# EAGLE schematic XMICRO-VDP V1.1 (EAGLE 6.3)

## Sheet 1 of 5: Bus Connections/Buffers
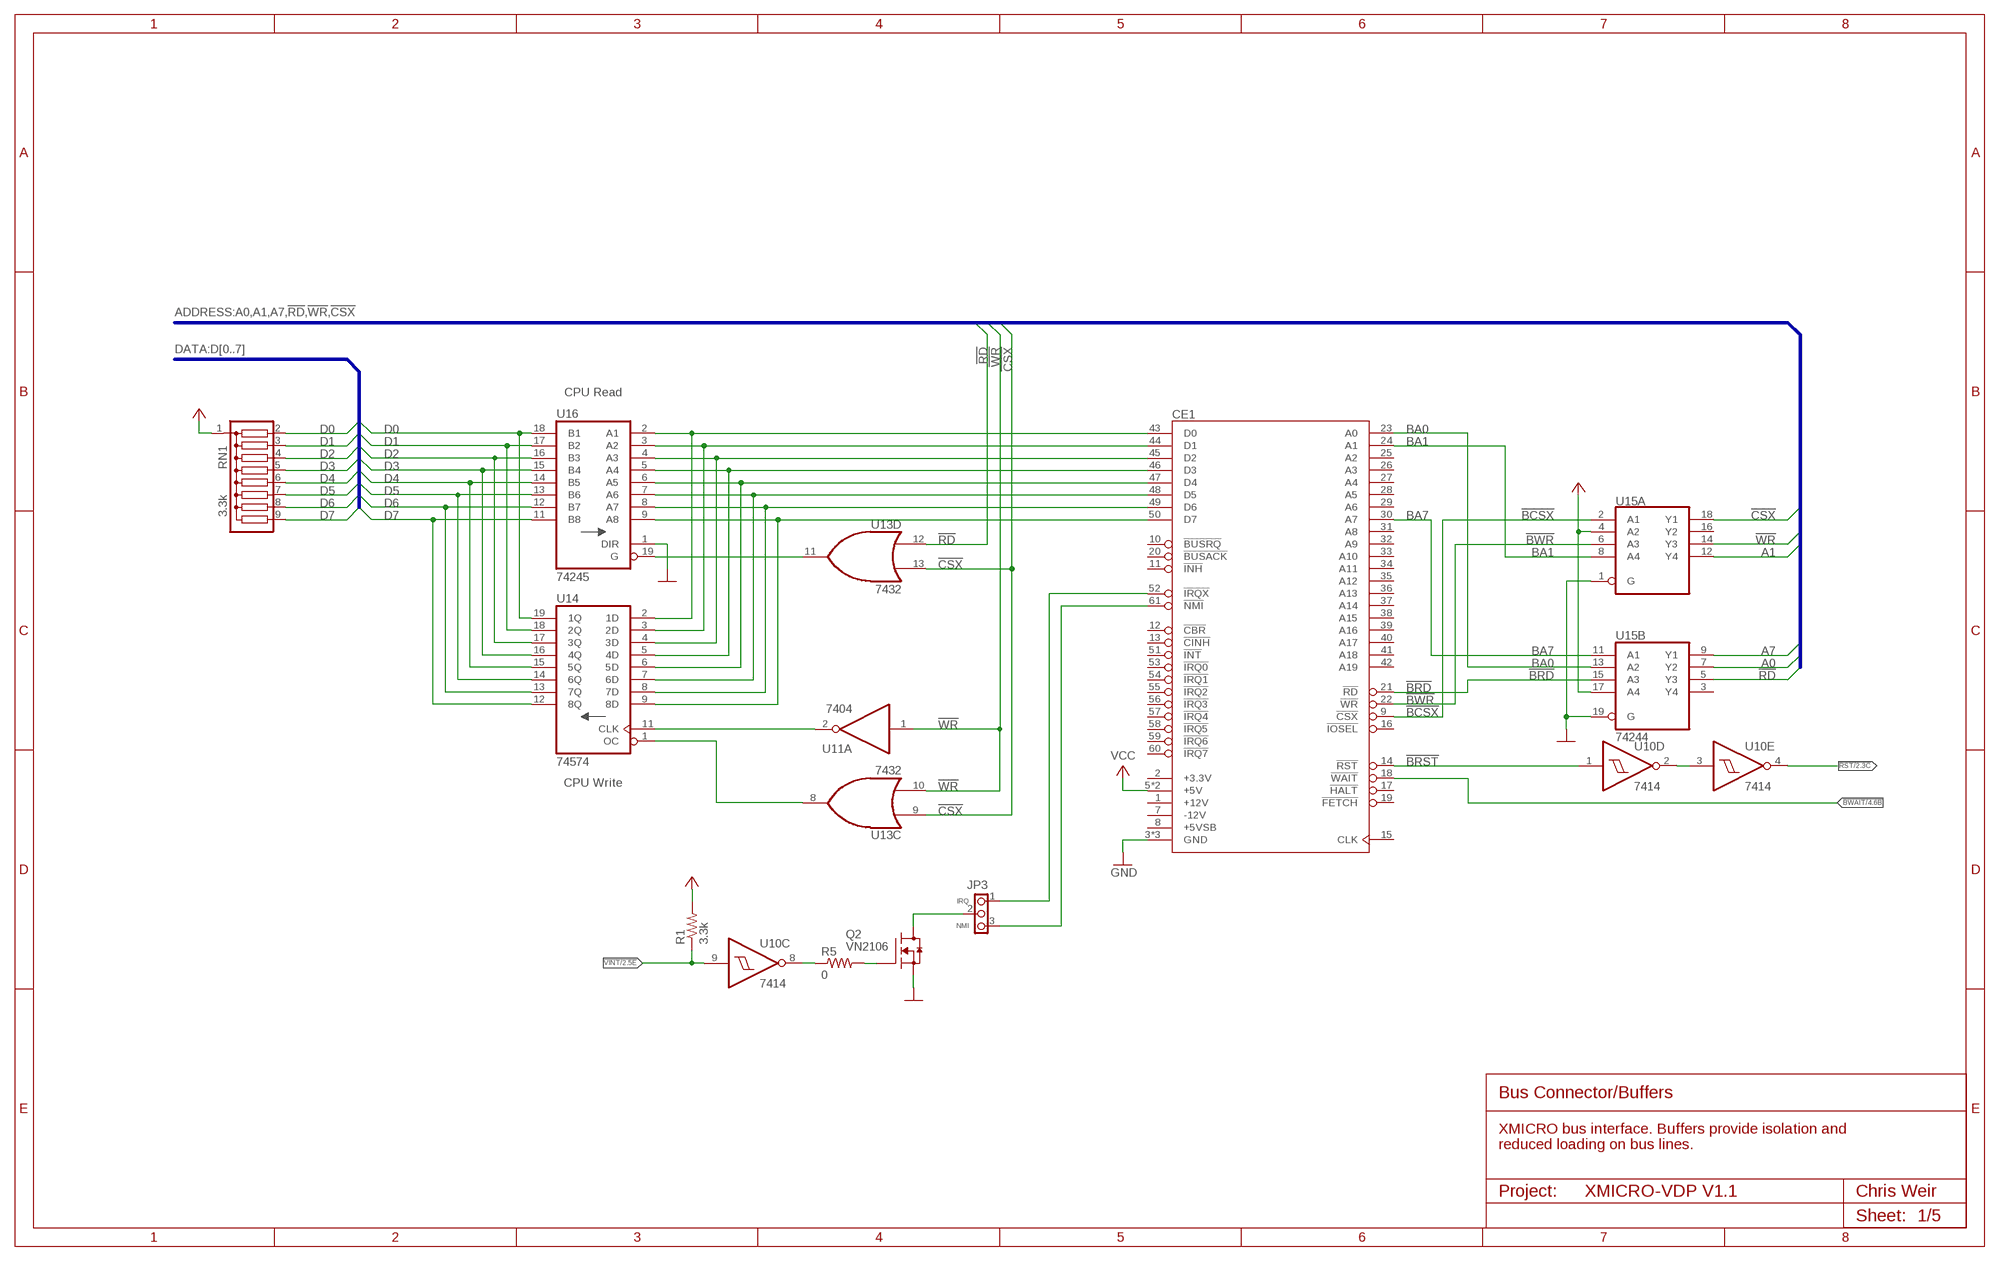
[diagram p0: schematic, sheet 1]

### Parts
CE1  XMICRO-BUS-EDGE62M  [EDGE62M]
JP3  PINHD1X3THRU  [1X03]
Q2  VN2106  [TO92]
R1  3.3k  R-US_0207/10  [0207/10]
R5  0  R-US_0207/10  [0207/10]
RN1  3.3k  RN8  [SIL9]
U10  7414  74LS14N  [DIL14]
U11  7404  74LS04N  [DIL14]
U13  7432  74LS32N  [DIL14]
U14  74574  74HC574N  [DIL20]
U15  74244  74LS244N  [DIL20]
U16  74245  74LS245N  [DIL20]

### Nets
!BCSX: CE1.9(!CSX) U15.2(A:A1)
!BRD: CE1.21(!RD) U15.15(B:A3)
!BRST: CE1.14(!RST) U10.1(D:I)
!BWAIT: CE1.18(!WAIT) ; also sheet 4
!BWR: CE1.22(!WR) U15.6(A:A3)
!CSX: U13.9(C:I0) U13.13(D:I1) U15.18(A:Y1) ; also sheet 2,4
!RD: U13.12(D:I0) U15.5(B:Y3) ; also sheet 2
!RST: U10.4(E:O) ; also sheet 2,4
!VINT: R1.1 U10.9(C:I) ; also sheet 2
!WR: U11.1(A:I) U13.10(C:I1) U15.14(A:Y3) ; also sheet 2
A0: U15.7(B:Y2) ; also sheet 2
A1: U15.12(A:Y4) ; also sheet 2
A7: U15.9(B:Y1) ; also sheet 2
BA0: CE1.23(A0) U15.13(B:A2)
BA1: CE1.24(A1) U15.8(A:A4)
BA7: CE1.30(A7) U15.11(B:A1)
D0: RN1.2 U14.19(1Q) U16.18(B1) ; also sheet 2,5
D1: RN1.3 U14.18(2Q) U16.17(B2) ; also sheet 2,5
D2: RN1.4 U14.17(3Q) U16.16(B3) ; also sheet 2,5
D3: RN1.5 U14.16(4Q) U16.15(B4) ; also sheet 2,5
D4: RN1.6 U14.15(5Q) U16.14(B5) ; also sheet 2,5
D5: RN1.7 U14.14(6Q) U16.13(B6) ; also sheet 2,5
D6: RN1.8 U14.13(7Q) U16.12(B7) ; also sheet 2,5
D7: RN1.9 U14.12(8Q) U16.11(B8) ; also sheet 2,5
GND [GND]: CE1.3(GND) CE1.4(GND) CE1.62(GND) Q2.1(S) U15.1(A:G) U15.19(B:G) U16.1(DIR) ; also sheet 2,3,4,5
N$9: Q2.2(G) R5.2
N$10: JP3.2 Q2.3(D)
N$11: R5.1 U10.8(C:O)
N$27: U10.2(D:O) U10.3(E:I)
N$33: CE1.50(D7) U14.9(8D) U16.9(A8)
N$34: CE1.49(D6) U14.8(7D) U16.8(A7)
N$35: CE1.48(D5) U14.7(6D) U16.7(A6)
N$36: CE1.47(D4) U14.6(5D) U16.6(A5)
N$37: CE1.46(D3) U14.5(4D) U16.5(A4)
N$38: CE1.45(D2) U14.4(3D) U16.4(A3)
N$39: CE1.44(D1) U14.3(2D) U16.3(A2)
N$40: CE1.43(D0) U14.2(1D) U16.2(A1)
N$54: U13.11(D:O) U16.19(G)
N$55: U11.2(A:O) U14.11(CLK)
N$56: U13.8(C:O) U14.1(OC)
N$72: CE1.61(!NMI) JP3.3
N$74: CE1.52(!IRQX) JP3.1
VCC [SUPPLY]: CE1.5(+5V) CE1.6(+5V) R1.2 RN1.1 U15.4(A:A2) U15.17(B:A4) ; also sheet 2,3,4,5
Unconnected: CE1.1(+12V) CE1.2(+3.3V) CE1.7(-12V) CE1.8(+5VSB) CE1.10(!BUSRQ) CE1.11(!INH) CE1.12(!CBR) CE1.13(!CINH) CE1.15(CLK) CE1.16(!IOSEL) CE1.17(!HALT) CE1.19(!FETCH) CE1.20(!BUSACK) CE1.25(A2) CE1.26(A3) CE1.27(A4) CE1.28(A5) CE1.29(A6) CE1.31(A8) CE1.32(A9) CE1.33(A10) CE1.34(A11) CE1.35(A12) CE1.36(A13) CE1.37(A14) CE1.38(A15) CE1.39(A16) CE1.40(A17) CE1.41(A18) CE1.42(A19) CE1.51(!INT) CE1.53(!IRQ0) CE1.54(!IRQ1) CE1.55(!IRQ2) CE1.56(!IRQ3) CE1.57(!IRQ4) CE1.58(!IRQ5) CE1.59(!IRQ6) CE1.60(!IRQ7) U15.3(B:Y4) U15.16(A:Y2)

### Buses
DATA:D[0..7]
ADDRESS:A0,A1,A7,!RD,!WR,!CSX

### Notes on the sheet
- CPU Read
- CPU Write
- IRQ
- NMI
- Bus Connector/Buffers
- XMICRO bus interface. Buffers provide isolation and 
  reduced loading on bus lines.
- Project: | Chris Weir
- Sheet:

## Sheet 2 of 5: VDP - Digital
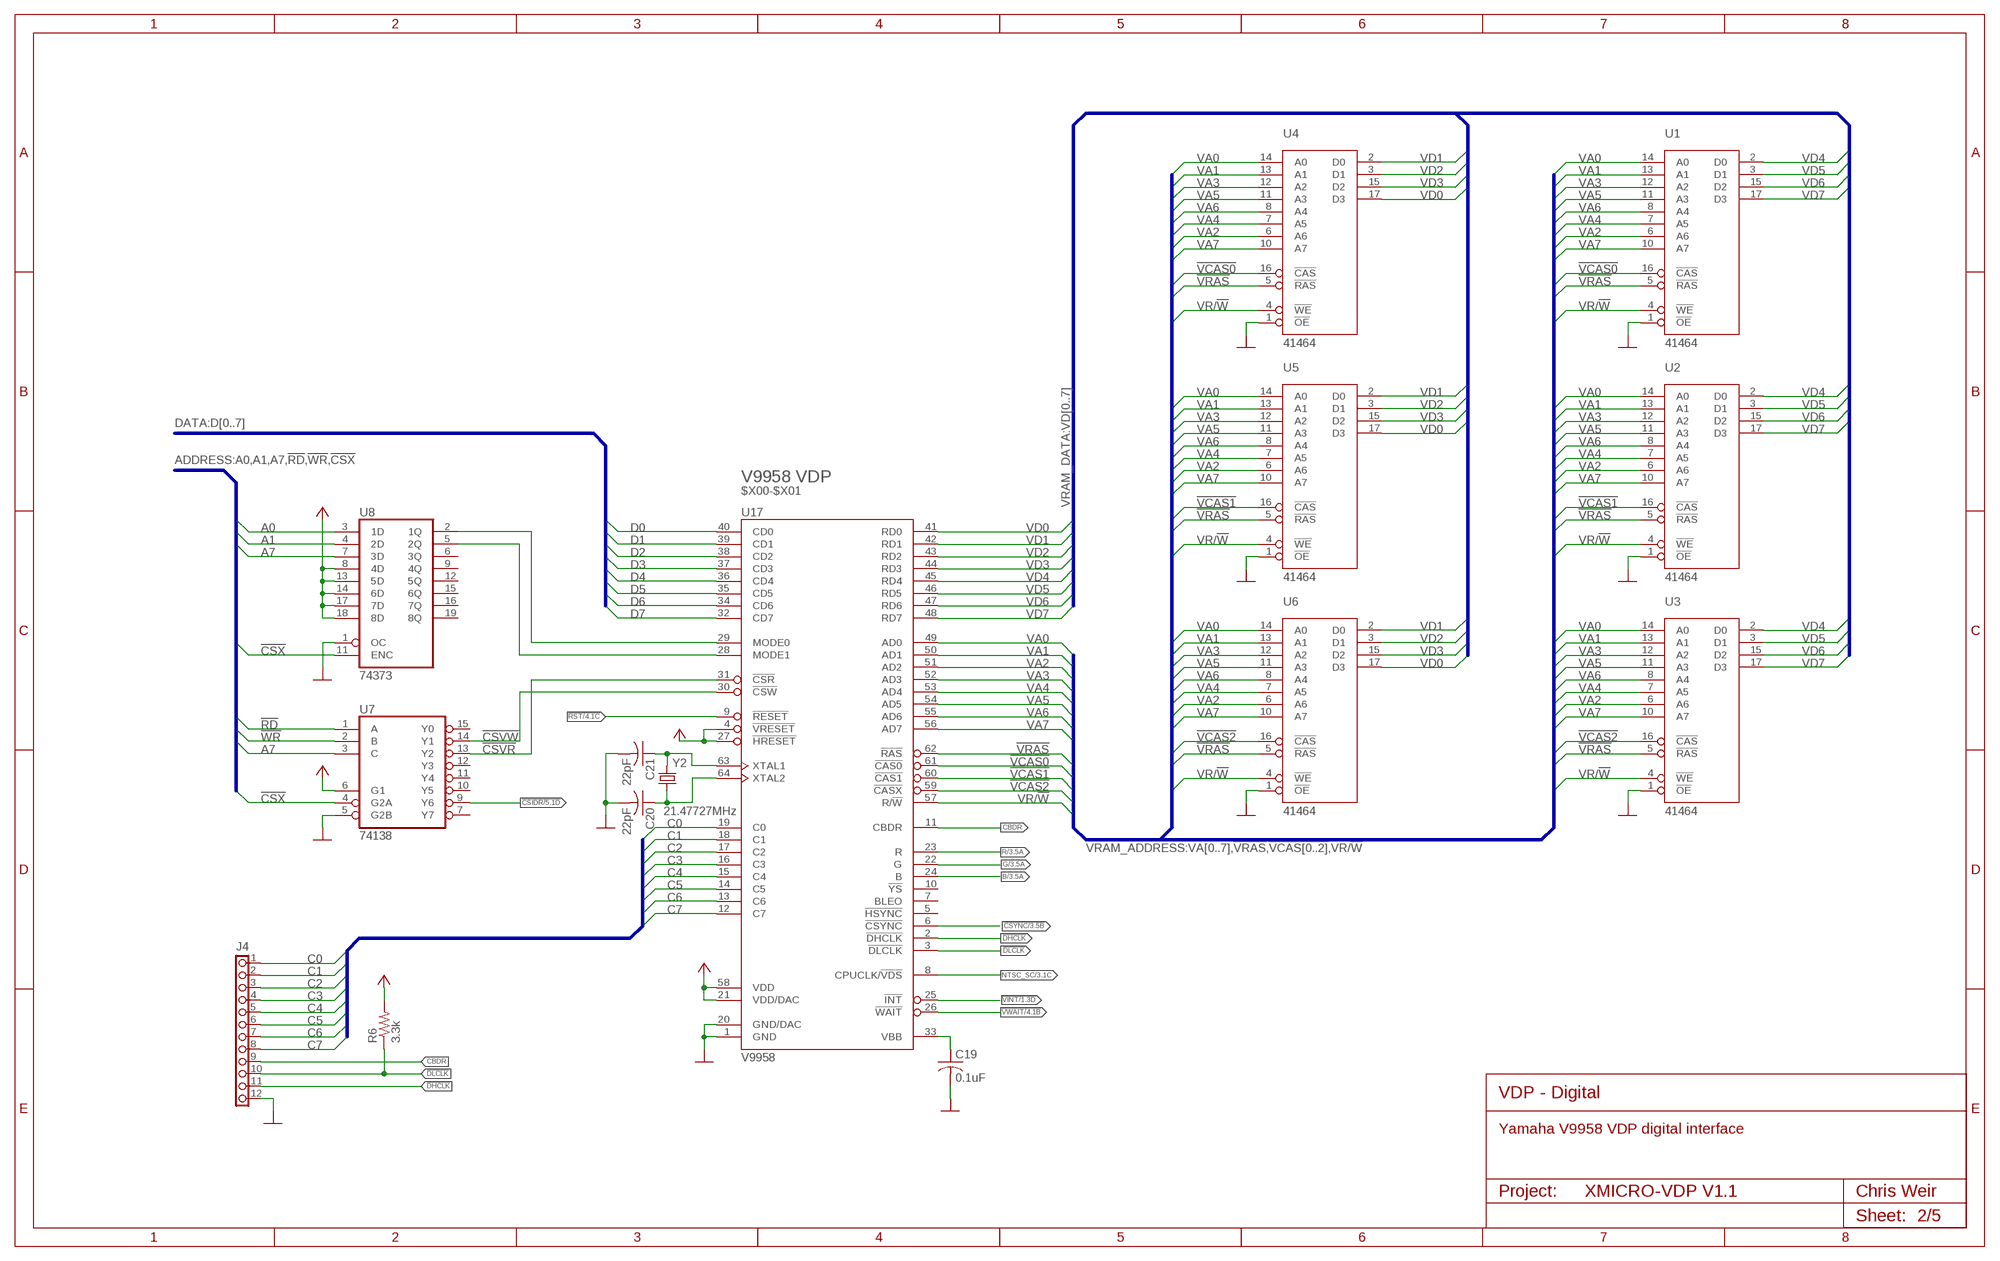
[diagram p1: schematic, sheet 2]

### Parts
C19  0.1uF  C-US100  [C100]
C20  22pF  C-US100  [C100]
C21  22pF  C-US100  [C100]
J4  PINHD-2X6  [2X06]
R6  3.3k  R-US_0207/10  [0207/10]
U1  41464  [DIL18]
U2  41464  [DIL18]
U3  41464  [DIL18]
U4  41464  [DIL18]
U5  41464  [DIL18]
U6  41464  [DIL18]
U7  74138  74S138N  [DIL16]
U8  74373  74LS373N  [DIL20]
U17  V9958  [SDIP64]
Y2  21.47727MHz  CRYSTAL  [HC-49US]

### Nets
!CSIDR: U7.9(Y6) ; also sheet 5
!CSVR: U7.13(Y2) U17.31(!CSR)
!CSVW: U7.14(Y1) U17.30(!CSW)
!CSX: U7.4(G2A) U8.11(ENC) ; also sheet 1,4
!CSYNC: U17.6(!CSYNC) ; also sheet 3
!DHCLK: J4.11 U17.2(!DHCLK)
!DLCLK: J4.10 R6.1 U17.3(!DLCLK)
!RD: U7.1(A) ; also sheet 1
!RST: U17.9(!RESET) ; also sheet 1,4
!VCAS0: U1.16(!CAS) U4.16(!CAS) U17.61(!CAS0)
!VCAS1: U2.16(!CAS) U5.16(!CAS) U17.60(!CAS1)
!VCAS2: U3.16(!CAS) U6.16(!CAS) U17.59(!CASX)
!VINT: U17.25(!INT) ; also sheet 1
!VRAS: U1.5(!RAS) U2.5(!RAS) U3.5(!RAS) U4.5(!RAS) U5.5(!RAS) U6.5(!RAS) U17.62(!RAS)
!VWAIT: U17.26(!WAIT) ; also sheet 4
!WR: U7.2(B) ; also sheet 1
A0: U8.3(1D) ; also sheet 1
A1: U8.4(2D) ; also sheet 1
A7: U7.3(C) U8.7(3D) ; also sheet 1
B: U17.24(B) ; also sheet 3
C0: J4.1 U17.19(C0)
C1: J4.2 U17.18(C1)
C2: J4.3 U17.17(C2)
C3: J4.4 U17.16(C3)
C4: J4.5 U17.15(C4)
C5: J4.6 U17.14(C5)
C6: J4.7 U17.13(C6)
C7: J4.8 U17.12(C7)
CBDR: J4.9 U17.11(CBDR)
D0: U17.40(CD0) ; also sheet 1,5
D1: U17.39(CD1) ; also sheet 1,5
D2: U17.38(CD2) ; also sheet 1,5
D3: U17.37(CD3) ; also sheet 1,5
D4: U17.36(CD4) ; also sheet 1,5
D5: U17.35(CD5) ; also sheet 1,5
D6: U17.34(CD6) ; also sheet 1,5
D7: U17.32(CD7) ; also sheet 1,5
G: U17.22(G) ; also sheet 3
GND [GND]: C19.P$2 C20.P$2 C21.P$2 J4.12 U1.1(!OE) U2.1(!OE) U3.1(!OE) U4.1(!OE) U5.1(!OE) U6.1(!OE) U7.5(G2B) U8.1(OC) U17.1(GND) U17.20(GND/DAC) ; also sheet 1,3,4,5
N$28: C21.P$1 U17.63(XTAL1) Y2.2
N$30: C20.P$1 U17.64(XTAL2) Y2.1
N$69: U8.2(1Q) U17.29(MODE0)
N$70: C19.P$1 U17.33(VBB)
N$75: U8.5(2Q) U17.28(MODE1)
NTSC_SC: U17.8(CPUCLK/!VDS) ; also sheet 3
R: U17.23(R) ; also sheet 3
VA0: U1.14(A0) U2.14(A0) U3.14(A0) U4.14(A0) U5.14(A0) U6.14(A0) U17.49(AD0)
VA1: U1.13(A1) U2.13(A1) U3.13(A1) U4.13(A1) U5.13(A1) U6.13(A1) U17.50(AD1)
VA2: U1.6(A6) U2.6(A6) U3.6(A6) U4.6(A6) U5.6(A6) U6.6(A6) U17.51(AD2)
VA3: U1.12(A2) U2.12(A2) U3.12(A2) U4.12(A2) U5.12(A2) U6.12(A2) U17.52(AD3)
VA4: U1.7(A5) U2.7(A5) U3.7(A5) U4.7(A5) U5.7(A5) U6.7(A5) U17.53(AD4)
VA5: U1.11(A3) U2.11(A3) U3.11(A3) U4.11(A3) U5.11(A3) U6.11(A3) U17.54(AD5)
VA6: U1.8(A4) U2.8(A4) U3.8(A4) U4.8(A4) U5.8(A4) U6.8(A4) U17.55(AD6)
VA7: U1.10(A7) U2.10(A7) U3.10(A7) U4.10(A7) U5.10(A7) U6.10(A7) U17.56(AD7)
VCC [SUPPLY]: R6.2 U7.6(G1) U8.8(4D) U8.13(5D) U8.14(6D) U8.17(7D) U8.18(8D) U17.4(!VRESET) U17.21(VDD/DAC) U17.27(!HRESET) U17.58(VDD) ; also sheet 1,3,4,5
VD0: U4.17(D3) U5.17(D3) U6.17(D3) U17.41(RD0)
VD1: U4.2(D0) U5.2(D0) U6.2(D0) U17.42(RD1)
VD2: U4.3(D1) U5.3(D1) U6.3(D1) U17.43(RD2)
VD3: U4.15(D2) U5.15(D2) U6.15(D2) U17.44(RD3)
VD4: U1.2(D0) U2.2(D0) U3.2(D0) U17.45(RD4)
VD5: U1.3(D1) U2.3(D1) U3.3(D1) U17.46(RD5)
VD6: U1.15(D2) U2.15(D2) U3.15(D2) U17.47(RD6)
VD7: U1.17(D3) U2.17(D3) U3.17(D3) U17.48(RD7)
VR/!W: U1.4(!WE) U2.4(!WE) U3.4(!WE) U4.4(!WE) U5.4(!WE) U6.4(!WE) U17.57(R/!W)
Unconnected: U7.7(Y7) U7.10(Y5) U7.11(Y4) U7.12(Y3) U7.15(Y0) U8.6(3Q) U8.9(4Q) U8.12(5Q) U8.15(6Q) U8.16(7Q) U8.19(8Q) U17.5(!HSYNC) U17.7(BLEO) U17.10(!YS)

### Buses
DATA:D[0..7]
ADDRESS:A0,A1,A7,!RD,!WR,!CSX
VRAM_DATA:VD[0..7]
VRAM_ADDRESS:VA[0..7],!VRAS,!VCAS[0..2],VR/!W
COLOR:C[0..7],CBDIR

### Notes on the sheet
- V9958 VDP
- $X00-$X01
- VDP - Digital
- Yamaha V9958 VDP digital interface
- Project: | Chris Weir
- Sheet:

## Sheet 3 of 5: Analog Video
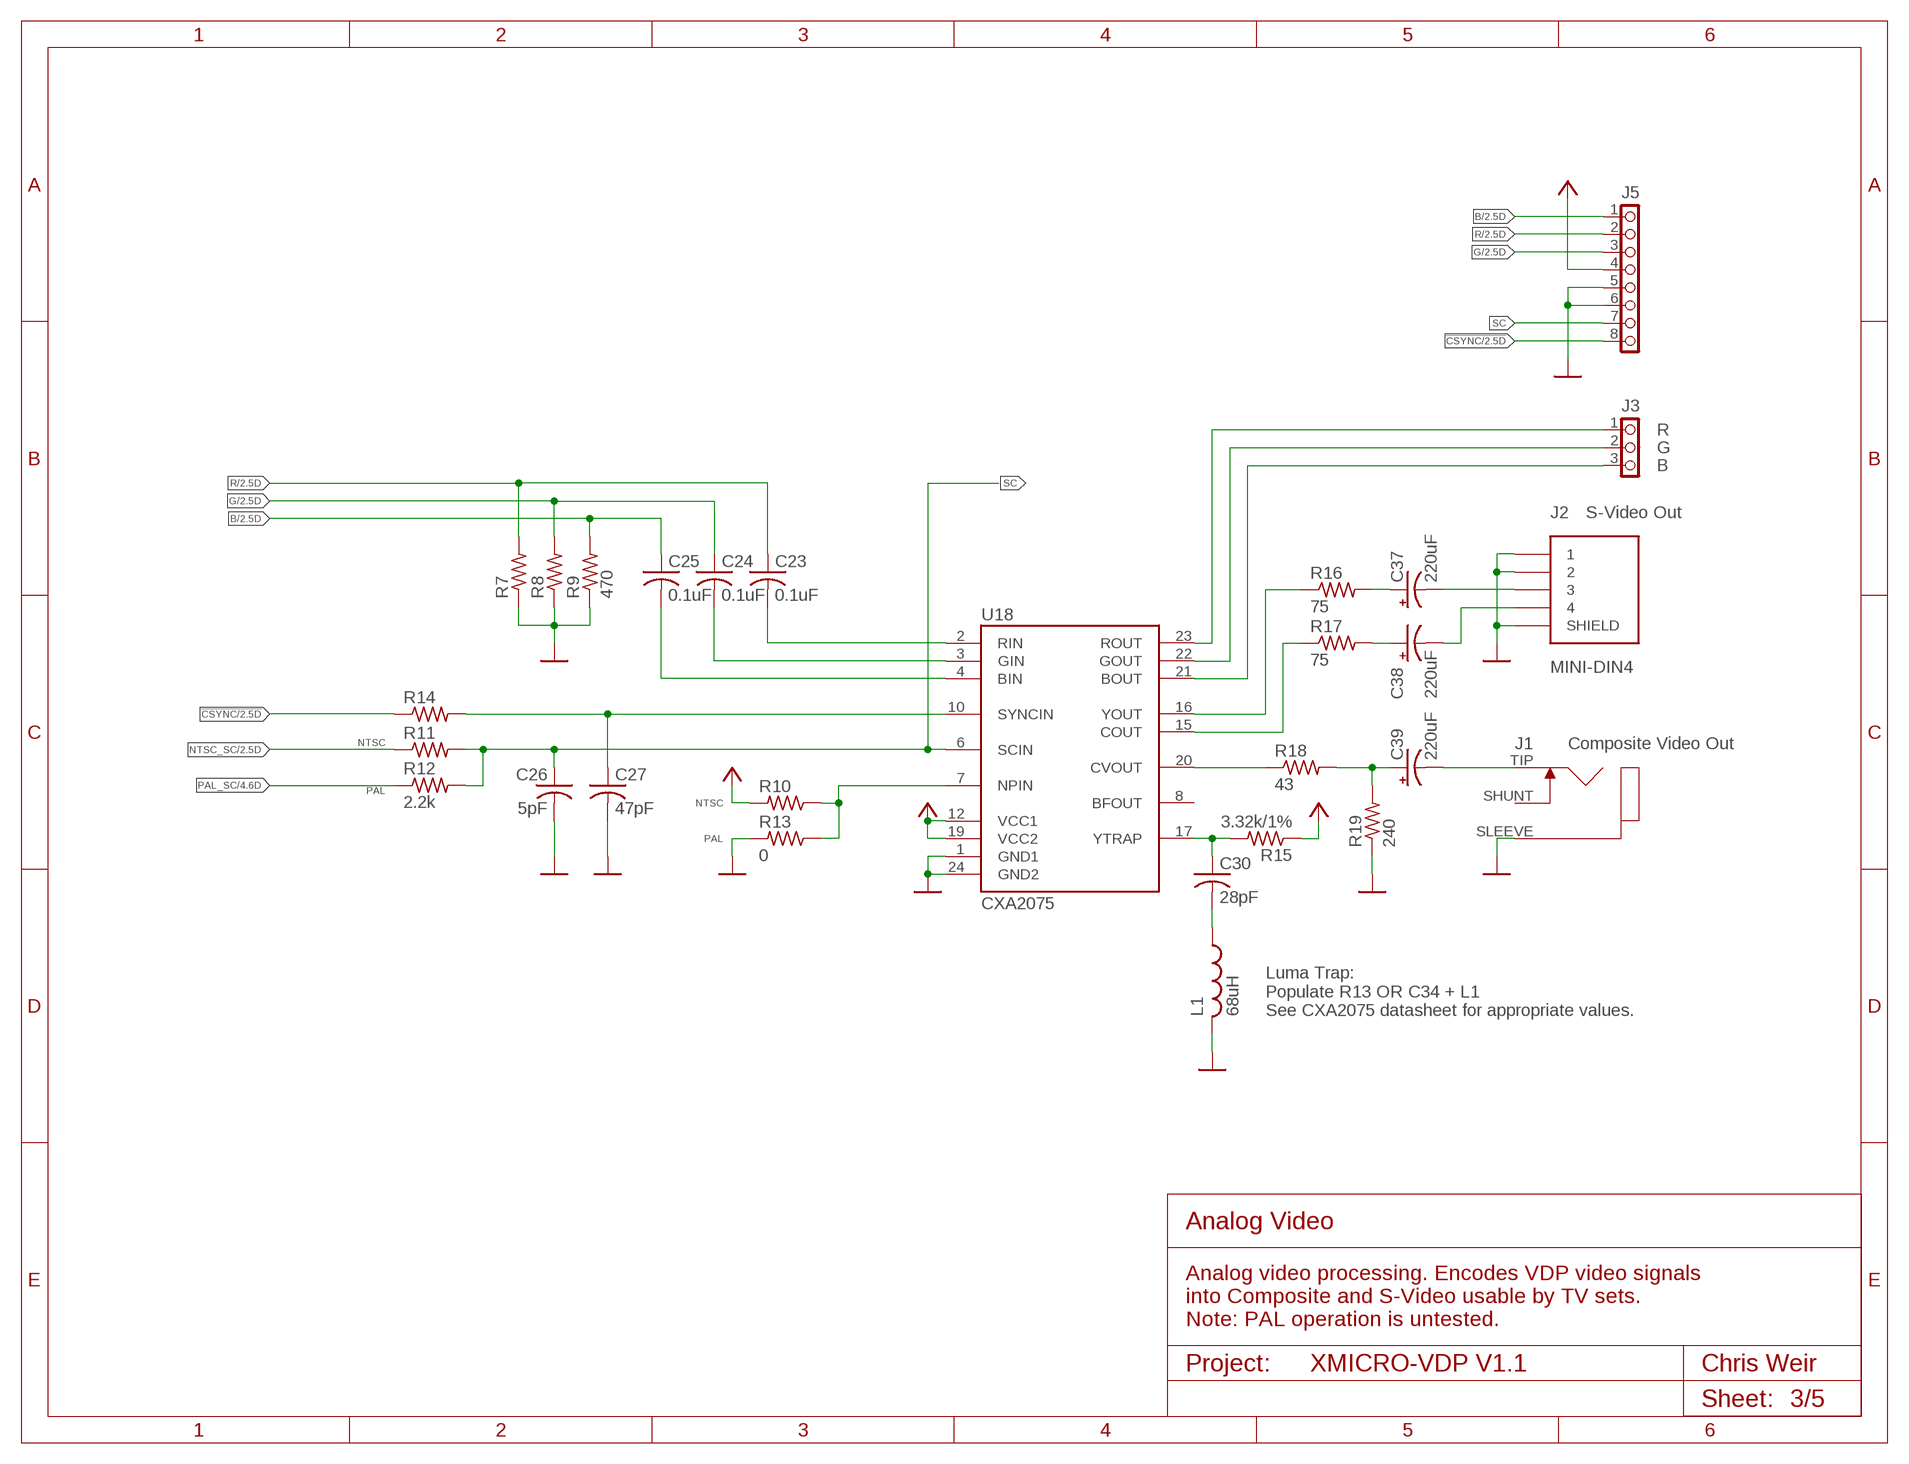
[diagram p2: schematic, sheet 3]

### Parts
C23  0.1uF  C-US100  [C100]
C24  0.1uF  C-US100  [C100]
C25  0.1uF  C-US100  [C100]
C26  5pF  C-US100  [C100]
C27  47pF  C-US100  [C100]
C30  28pF  C-US100  [C100]
C37  220uF  CPOL-USE2.5-7  [E2,5-7]
C38  220uF  CPOL-USE2.5-7  [E2,5-7]
C39  220uF  CPOL-USE2.5-7  [E2,5-7]
J1  PJRAN1XU04AUX  PJRAN1  [PJRAN1]
J2  MINI-DIN4  [MINI-DIN4]
J3  PINHD1X3  [1X03]
J5  PINHD-1X8  [1X08]
L1  68uH  L-US0207/10  [0207/10]
R7  470  R-US_0207/10  [0207/10]
R8  470  R-US_0207/10  [0207/10]
R9  470  R-US_0207/10  [0207/10]
R10  0  R-US_0207/10  [0207/10]
R11  2.2k  R-US_0207/10  [0207/10]
R12  2.2k  R-US_0207/10  [0207/10]
R13  0  R-US_0207/10  [0207/10]
R14  2.2k  R-US_0207/10  [0207/10]
R15  3.32k/1%  R-US_0207/10  [0207/10]
R16  75  R-US_0207/10  [0207/10]
R17  75  R-US_0207/10  [0207/10]
R18  43  R-US_0207/10  [0207/10]
R19  240  R-US_0207/10  [0207/10]
U18  CXA2075  [SOP-24]

### Nets
!CSYNC: J5.8 R14.1 ; also sheet 2
B: C25.P$1 J5.1 R9.2 ; also sheet 2
G: C24.P$1 J5.3 R8.2 ; also sheet 2
GND [GND]: C26.P$2 C27.P$2 J1.SLEEVE J2.1 J2.2 J2.G$1(SHIELD) J2.G$2(SHIELD) J2.G$3(SHIELD) J5.5 J5.6 L1.2 R7.1 R8.1 R9.1 R13.2 R19.1 U18.1(GND1) U18.24(GND2) ; also sheet 1,2,4,5
N$2: J3.3 U18.21(BOUT)
N$3: C23.P$2 U18.2(RIN)
N$4: C24.P$2 U18.3(GIN)
N$5: C25.P$2 U18.4(BIN)
N$6: J3.2 U18.22(GOUT)
N$7: J3.1 U18.23(ROUT)
N$12: R17.1 U18.15(COUT)
N$13: R16.1 U18.16(YOUT)
N$14: R18.1 U18.20(CVOUT)
N$15: C39.+ R18.2 R19.2
N$16: C37.+ R16.2
N$17: C38.+ R17.2
N$21: C30.P$2 L1.1
N$22: C27.P$1 R14.2 U18.10(SYNCIN)
N$26: R10.1 R13.1 U18.7(NPIN)
N$29: C38.- J2.4
N$53: C39.- J1.TIP
N$71: C30.P$1 R15.2 U18.17(YTRAP)
N$81: C37.- J2.3
NTSC_SC: R11.1 ; also sheet 2
PAL_SC: R12.1 ; also sheet 4
R: C23.P$1 J5.2 R7.2 ; also sheet 2
SC: C26.P$1 J5.7 R11.2 R12.2 U18.6(SCIN)
VCC [SUPPLY]: J5.4 R10.2 R15.1 U18.12(VCC1) U18.19(VCC2) ; also sheet 1,2,4,5
Unconnected: J1.SHUNT U18.8(BFOUT)

### Notes on the sheet
- R
- G
- B
- S-Video Out
- NTSC
- Composite Video Out
- PAL
- NTSC
- PAL
- Luma Trap:
  Populate R13 OR C34 + L1
  See CXA2075 datasheet for appropriate values.
- Analog Video
- Analog video processing. Encodes VDP video signals
  into Composite and S-Video usable by TV sets.
  Note: PAL operation is untested.
- Project: | Chris Weir
- Sheet:

## Sheet 4 of 5: Wait-State Generator
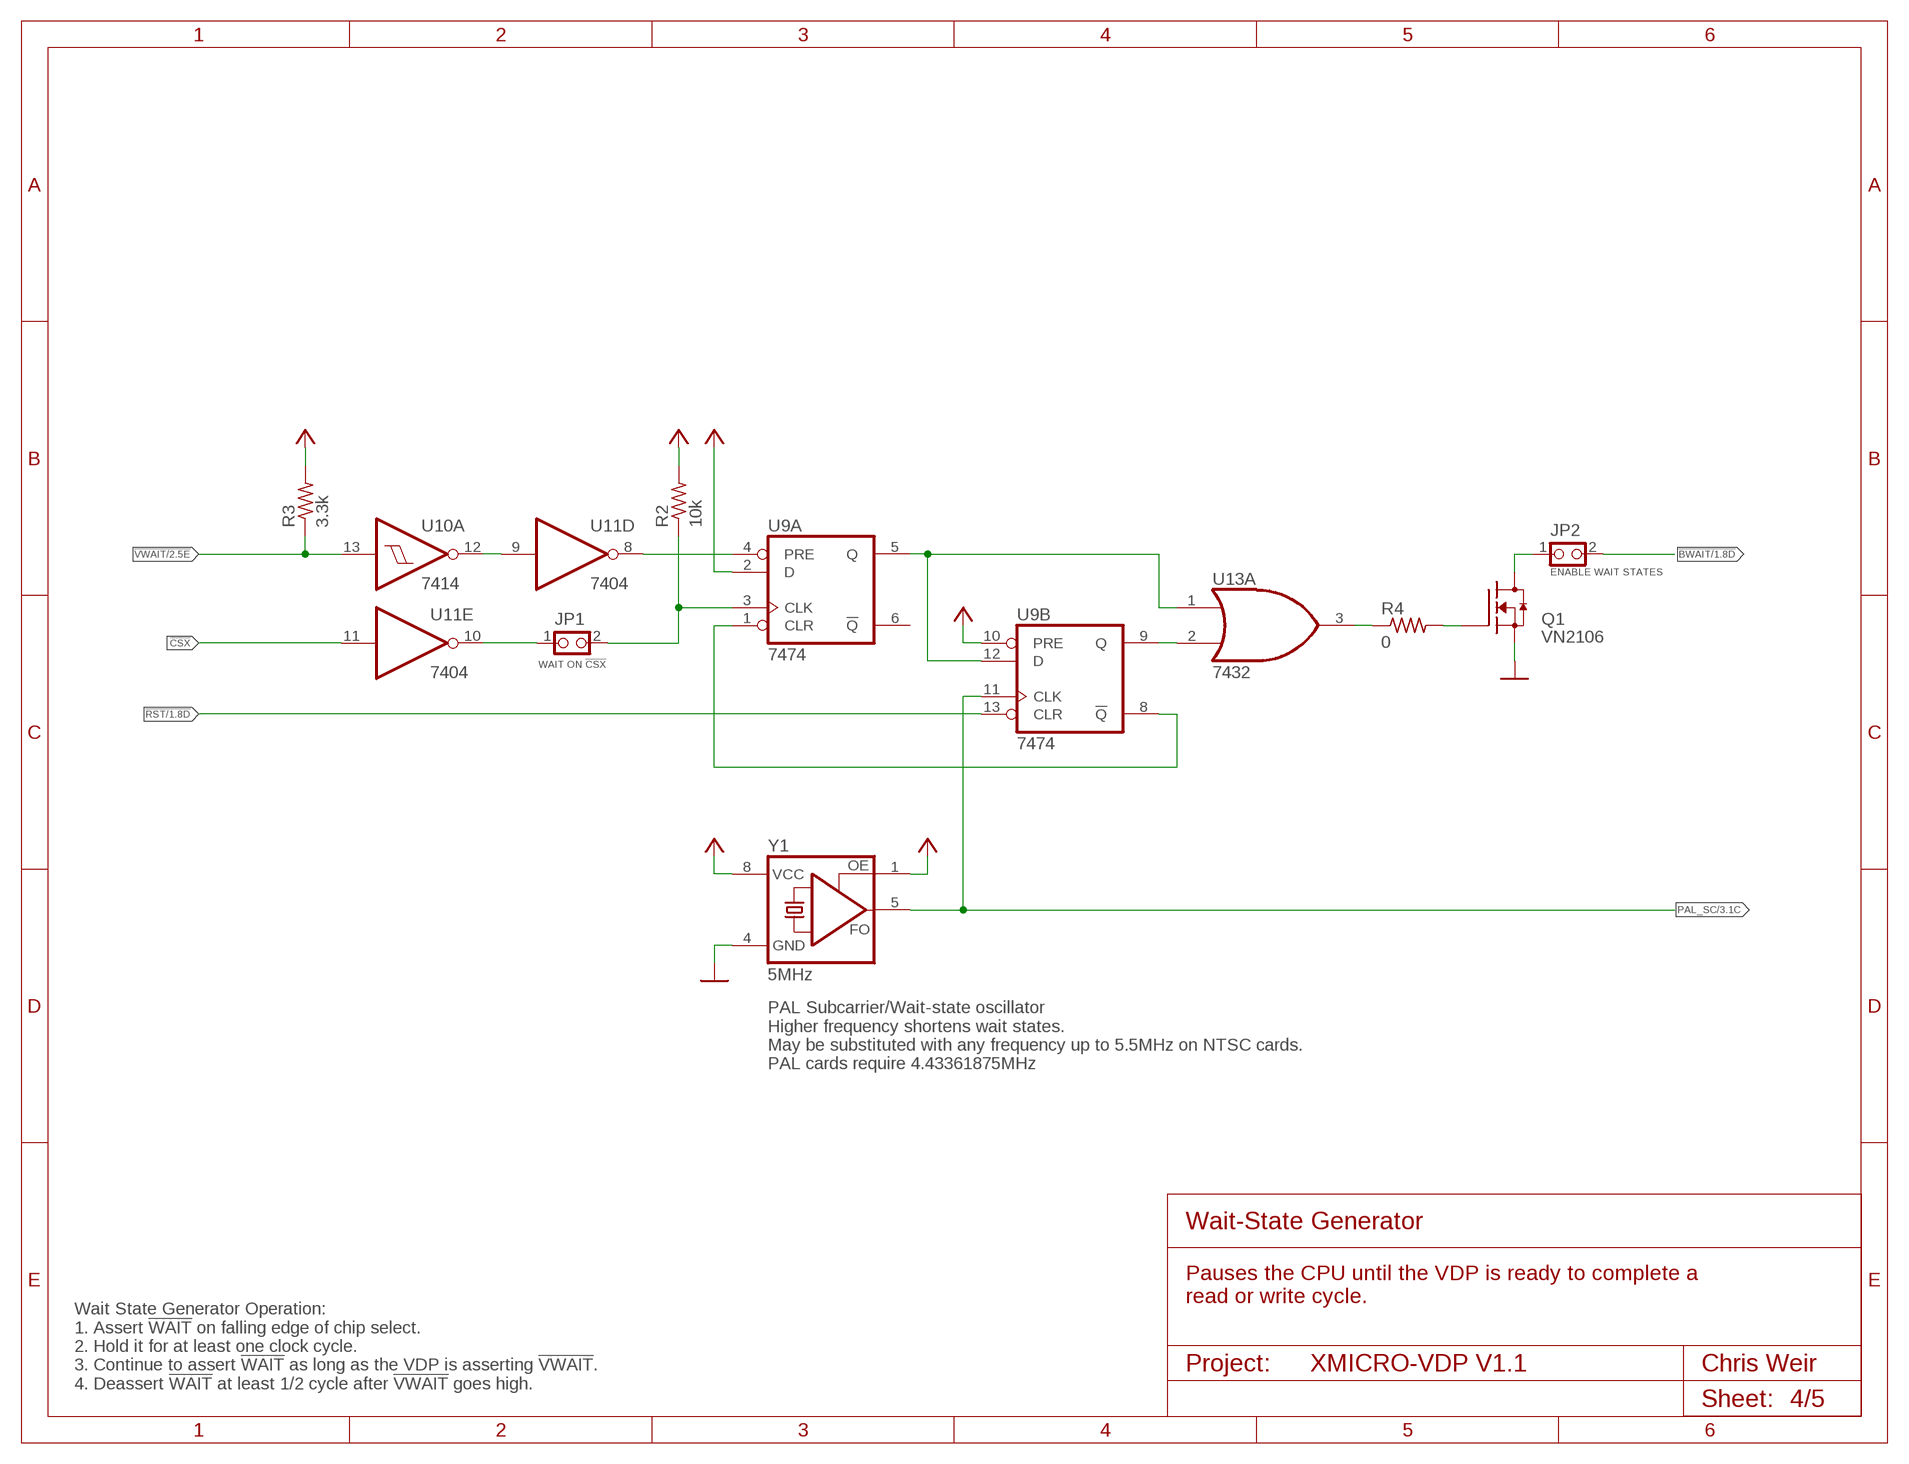
[diagram p3: schematic, sheet 4]

### Parts
JP1  PINHD-1X2THRU  [1X02]
JP2  PINHD-1X2THRU  [1X02]
Q1  VN2106  [TO92]
R2  10k  R-US_0207/10  [0207/10]
R3  3.3k  R-US_0207/10  [0207/10]
R4  0  R-US_0207/10  [0207/10]
U9  7474  74LS74N  [DIL14]
Y1  5MHz  OSC-OE  [DIL08S]

### Nets
!BWAIT: JP2.2 ; also sheet 1
!CSX: U11.11(E:I) ; also sheet 1,2
!RST: U9.13(B:CLR) ; also sheet 1,2
!VWAIT: R3.1 U10.13(A:I) ; also sheet 2
GND [GND]: Q1.1(S) Y1.4(GND) ; also sheet 1,2,3,5
N$1: U9.9(B:Q) U13.2(A:I1)
N$18: JP2.1 Q1.3(D)
N$19: U9.4(A:PRE) U11.8(D:O)
N$20: U10.12(A:O) U11.9(D:I)
N$51: Q1.2(G) R4.2
N$52: JP1.1 U11.10(E:O)
N$73: R4.1 U13.3(A:O)
N$77: U9.5(A:Q) U9.12(B:D) U13.1(A:I0)
N$79: U9.1(A:CLR) U9.8(B:!Q)
N$83: JP1.2 R2.1 U9.3(A:CLK)
PAL_SC: U9.11(B:CLK) Y1.5(FO) ; also sheet 3
VCC [SUPPLY]: R2.2 R3.2 U9.2(A:D) U9.10(B:PRE) Y1.1(OE) Y1.8(VCC) ; also sheet 1,2,3,5
Unconnected: U9.6(A:!Q)

### Notes on the sheet
- ENABLE WAIT STATES
- WAIT ON !CSX!
- PAL Subcarrier/Wait-state oscillator
  Higher frequency shortens wait states.
  May be substituted with any frequency up to 5.5MHz on NTSC cards.
  PAL cards require 4.43361875MHz
- Wait-State Generator
- Pauses the CPU until the VDP is ready to complete a
  read or write cycle.
- Project: | Chris Weir
- Wait State Generator Operation:
  1. Assert !WAIT! on falling edge of chip select.
  2. Hold it for at least one clock cycle.
  3. Continue to assert !WAIT! as long as the VDP is asserting !VWAIT!.
  4. Deassert !WAIT! at least 1/2 cycle after !VWAIT! goes high.
- Sheet:

## Sheet 5 of 5: Misc.
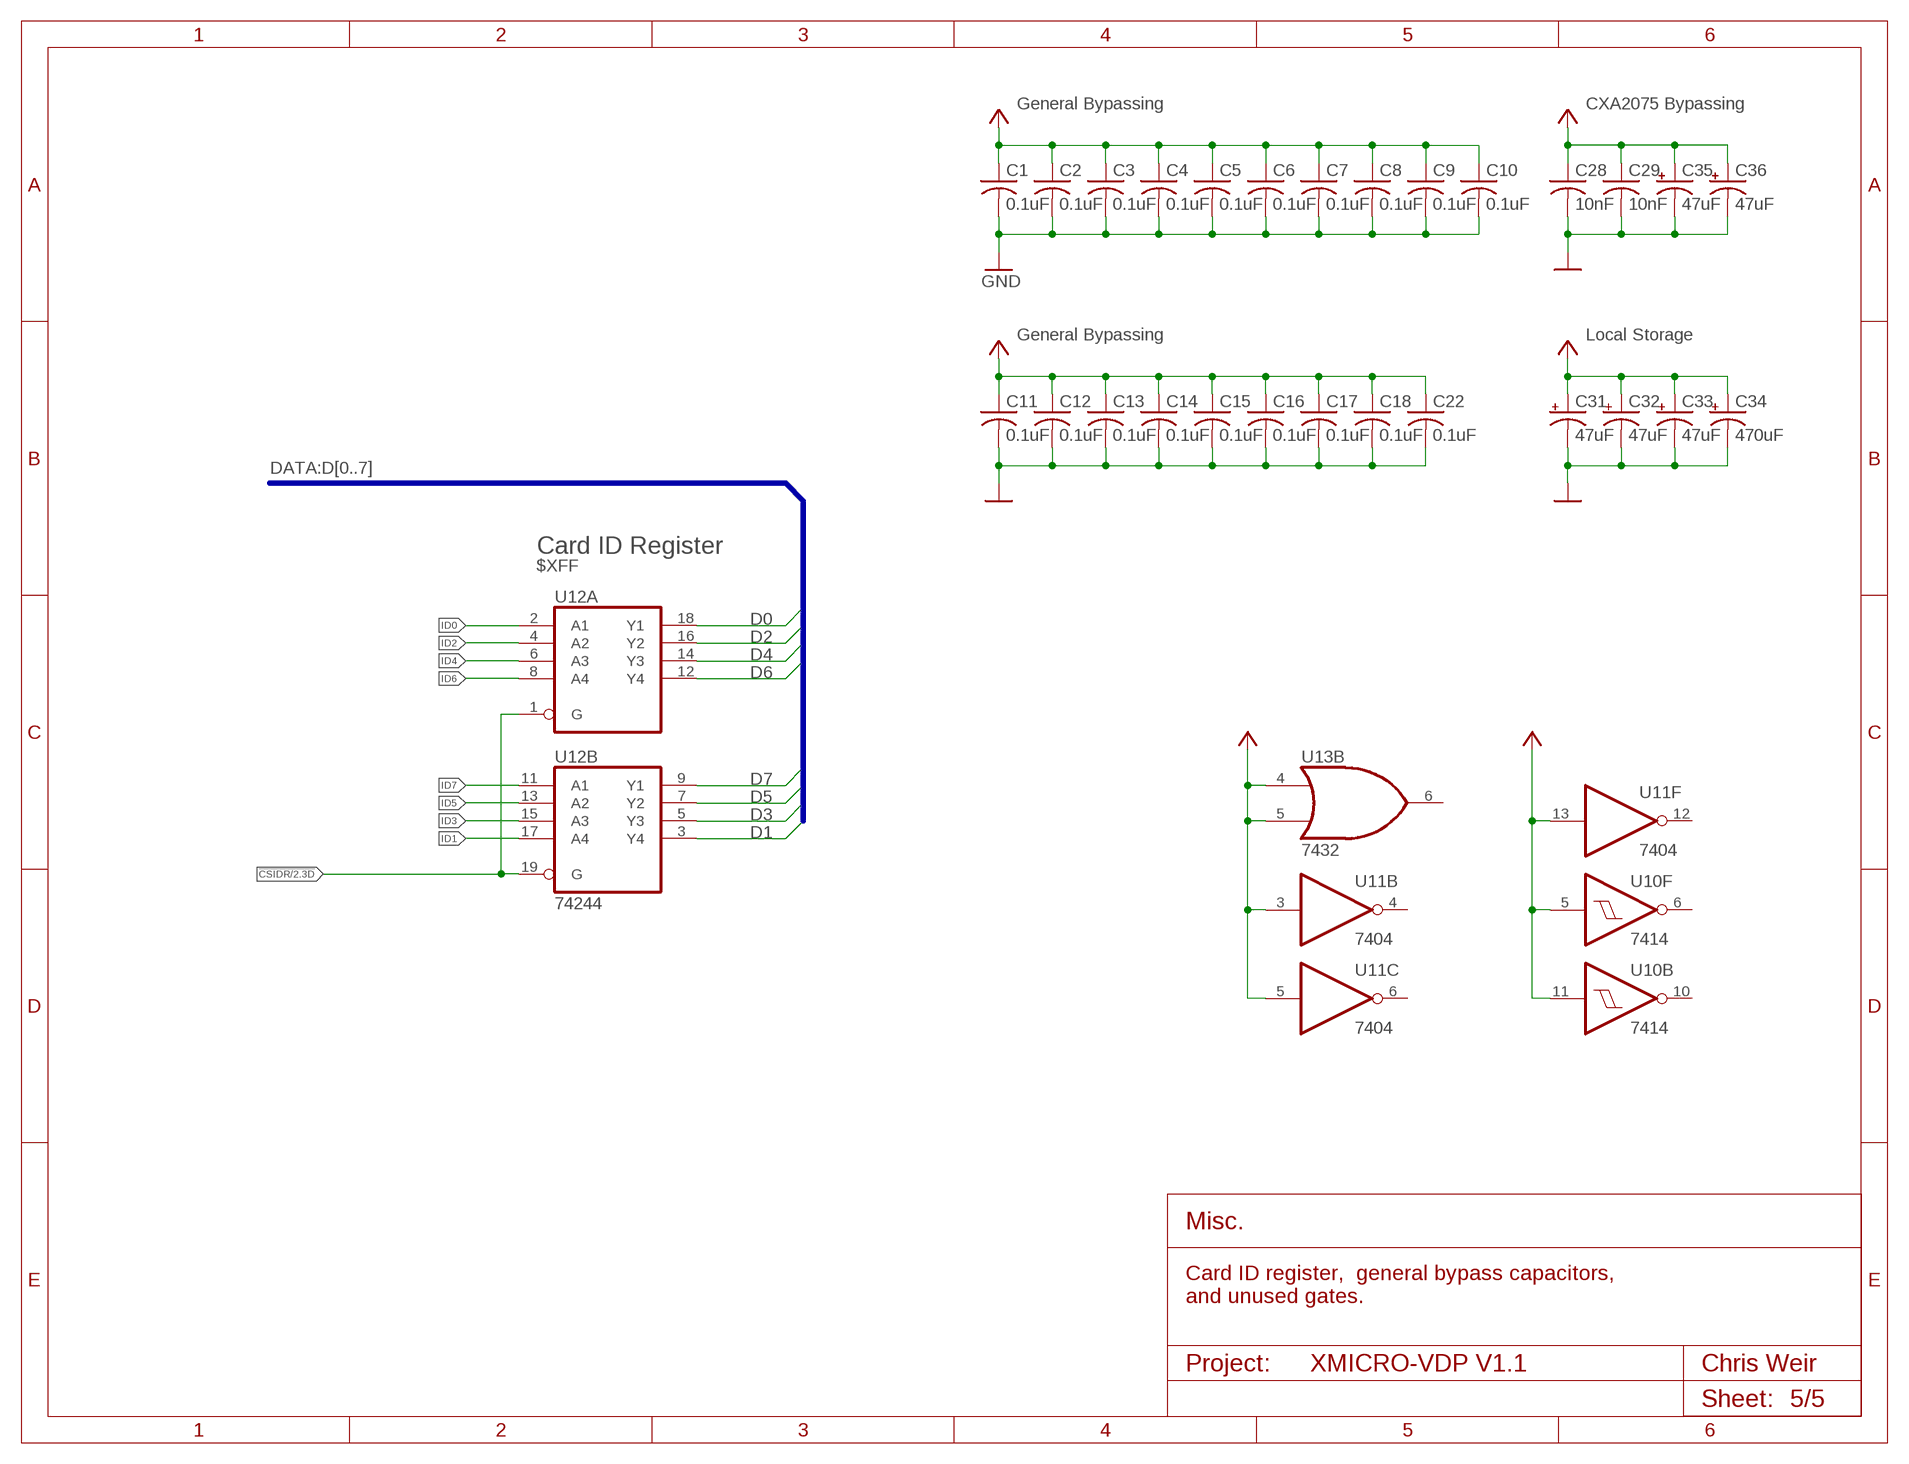
[diagram p4: schematic, sheet 5]

### Parts
C1  0.1uF  C-US100  [C100]
C2  0.1uF  C-US100  [C100]
C3  0.1uF  C-US100  [C100]
C4  0.1uF  C-US100  [C100]
C5  0.1uF  C-US100  [C100]
C6  0.1uF  C-US100  [C100]
C7  0.1uF  C-US100  [C100]
C8  0.1uF  C-US100  [C100]
C9  0.1uF  C-US100  [C100]
C10  0.1uF  C-US100  [C100]
C11  0.1uF  C-US100  [C100]
C12  0.1uF  C-US100  [C100]
C13  0.1uF  C-US100  [C100]
C14  0.1uF  C-US100  [C100]
C15  0.1uF  C-US100  [C100]
C16  0.1uF  C-US100  [C100]
C17  0.1uF  C-US100  [C100]
C18  0.1uF  C-US100  [C100]
C22  0.1uF  C-US100  [C100]
C28  10nF  C-US100  [C100]
C29  10nF  C-US050-024X044  [C050-024X044]
C31  47uF  CPOL-USE2.5-6  [E2,5-6]
C32  47uF  CPOL-USE2.5-6  [E2,5-6]
C33  47uF  CPOL-USE2.5-6  [E2,5-6]
C34  470uF  CPOL-US-10-5  [C-10-5]
C35  47uF  CPOL-USE2.5-6  [E2,5-6]
C36  47uF  CPOL-USE2.5-6  [E2,5-6]
U12  74244  74LS244N  [DIL20]

### Nets
!CSIDR: U12.1(A:G) U12.19(B:G) ; also sheet 2
D0: U12.18(A:Y1) ; also sheet 1,2
D1: U12.3(B:Y4) ; also sheet 1,2
D2: U12.16(A:Y2) ; also sheet 1,2
D3: U12.5(B:Y3) ; also sheet 1,2
D4: U12.14(A:Y3) ; also sheet 1,2
D5: U12.7(B:Y2) ; also sheet 1,2
D6: U12.12(A:Y4) ; also sheet 1,2
D7: U12.9(B:Y1) ; also sheet 1,2
GND [GND]: C1.P$2 C2.P$2 C3.P$2 C4.P$2 C5.P$2 C6.P$2 C7.P$2 C8.P$2 C9.P$2 C10.P$2 C11.P$2 C12.P$2 C13.P$2 C14.P$2 C15.P$2 C16.P$2 C17.P$2 C18.P$2 C22.P$2 C28.P$2 C29.2 C31.- C32.- C33.- C34.- C35.- C36.- ; also sheet 1,2,3,4
ID0: U12.2(A:A1)
ID1: U12.17(B:A4)
ID2: U12.4(A:A2)
ID3: U12.15(B:A3)
ID4: U12.6(A:A3)
ID5: U12.13(B:A2)
ID6: U12.8(A:A4)
ID7: U12.11(B:A1)
VCC [SUPPLY]: C1.P$1 C2.P$1 C3.P$1 C4.P$1 C5.P$1 C6.P$1 C7.P$1 C8.P$1 C9.P$1 C10.P$1 C11.P$1 C12.P$1 C13.P$1 C14.P$1 C15.P$1 C16.P$1 C17.P$1 C18.P$1 C22.P$1 C28.P$1 C29.1 C31.+ C32.+ C33.+ C34.+ C35.+ C36.+ U10.5(F:I) U10.11(B:I) U11.3(B:I) U11.5(C:I) U11.13(F:I) U13.4(B:I0) U13.5(B:I1) ; also sheet 1,2,3,4
Unconnected: U10.6(F:O) U10.10(B:O) U11.4(B:O) U11.6(C:O) U11.12(F:O) U13.6(B:O)

### Buses
DATA:D[0..7]

### Notes on the sheet
- General Bypassing | CXA2075 Bypassing
- General Bypassing | Local Storage
- Card ID Register
- $XFF
- Misc.
- Card ID register,  general bypass capacitors,
  and unused gates.
- Project: | Chris Weir
- Sheet:

## Power pins joined to a net without a drawn wire
GND: U1.18(GND) U2.18(GND) U3.18(GND) U4.18(GND) U5.18(GND) U6.18(GND) U7.8(GND) U8.10(GND) U9.7(P:GND) U10.7(P:GND) U11.7(P:GND) U12.10(P:GND) U13.7(P:GND) U14.10(GND) U15.10(P:GND) U16.10(GND)
VCC: U1.9(VCC) U2.9(VCC) U3.9(VCC) U4.9(VCC) U5.9(VCC) U6.9(VCC) U7.16(VCC) U8.20(VCC) U9.14(P:VCC) U10.14(P:VCC) U11.14(P:VCC) U12.20(P:VCC) U13.14(P:VCC) U14.20(VCC) U15.20(P:VCC) U16.20(VCC)

## Library data of the parts
C1-C28 C30 = Custom:C-US
C29 = rcl:C-US: CAPACITOR, American symbol
C31-C33 C35-C39 = rcl:CPOL-US: POLARIZED CAPACITOR, American symbol
C34 = Custom:CPOL-US
CE1 = Custom:XMICRO-BUS
J1 = Custom:PJRAN1
J2 = Custom:MINI-DIN4
J3 = Custom:PINHD1X3
J4 = Custom:PINHD-2X6
J5 = Custom:PINHD-1X8
JP1 JP2 = Custom:PINHD-1X2THRU
JP3 = Custom:PINHD1X3THRU
L1 = rcl:L-US: INDUCTOR, American symbol
Q1 Q2 = Custom:VN2106
R1-R19 = rcl:R-US_: RESISTOR, American symbol
RN1 = Custom:RN8
U1-U6 = Custom:41464
U7 = 74xx-us:74*138: 3-line to 8-line DECODER/DEMULTIPLEXER
U8 = 74xx-us:74*373: Octal D type transparent LATCH, edge triggered
U9 = 74xx-us:74*74: Dual D type positive edge triggered FLIP FLOP, preset and clear
U10 = 74xx-us:74*14: Hex schmitt trigger INVERTER
U11 = 74xx-us:74*04: Hex INVERTER
U12 U15 = 74xx-us:74*244: Octal BUFFER and LINE DRIVER, 3-state
U13 = 74xx-us:74*32: Quad 2-input OR gate
U14 = 74xx-us:74*574: 8-bit D type FLIP FLOP bus driver
U16 = 74xx-us:74*245: Octal BUS TRANSCEIVER, 3-state
U17 = Custom:V9958
U18 = Custom:CXA2075
Y1 = Custom:OSC-OE
Y2 = Custom:CRYSTAL

## Net classes
0 default: width 0.254 mm
1 GND: width 0.254 mm, clearance 0.254 mm to class 0
2 SUPPLY: width 0.254 mm, clearance 0.254 mm to class 0, clearance 0.381 mm to class 1
3 LOGO: width 0.152 mm